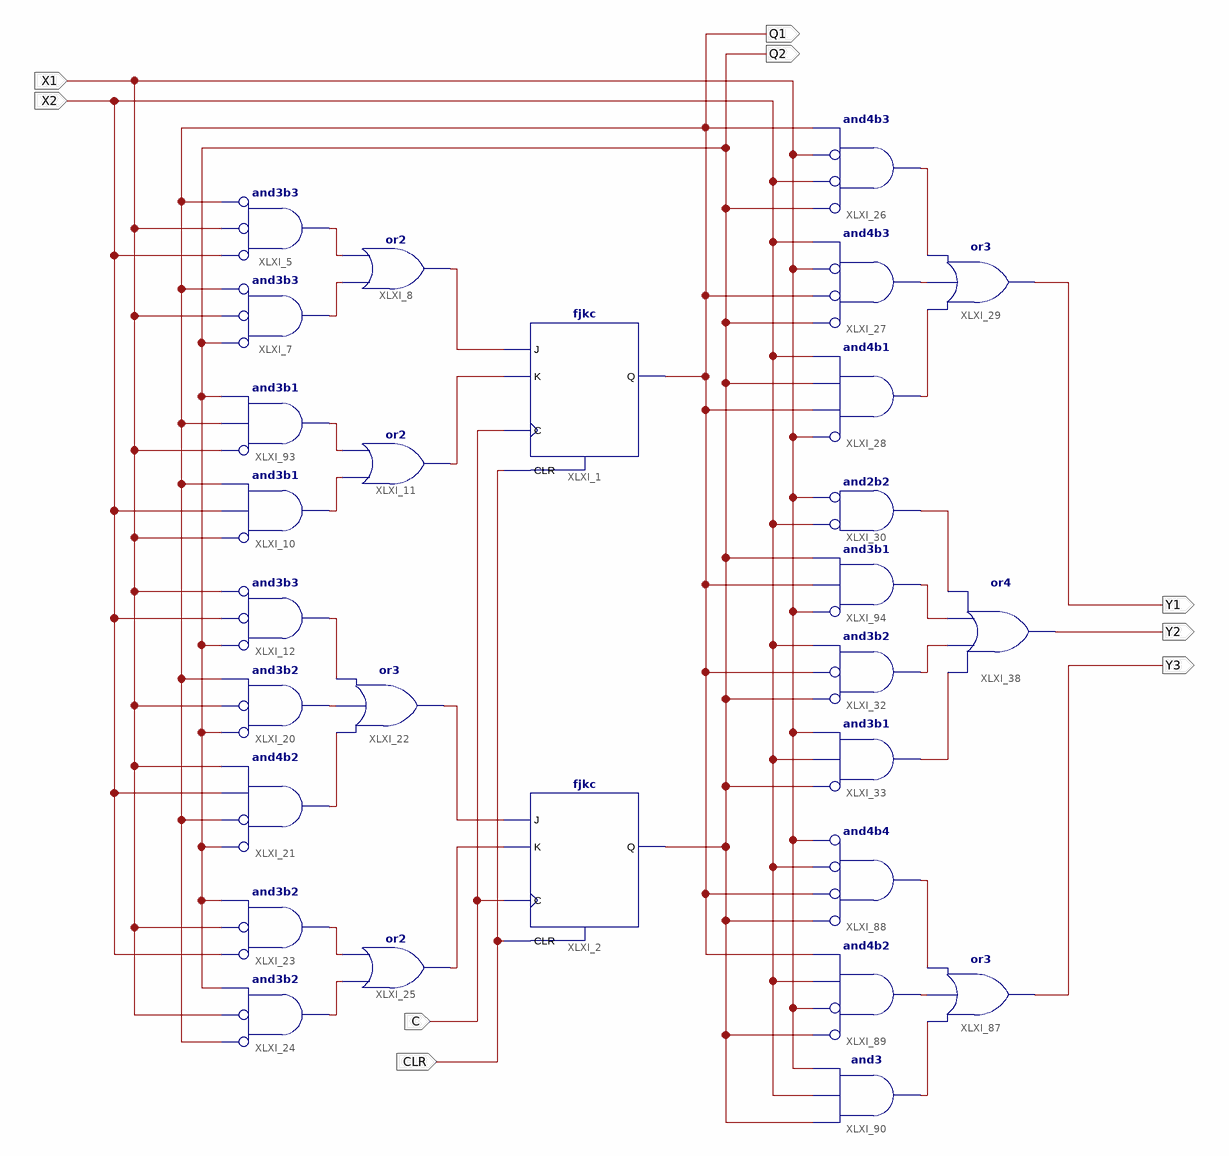
[diagram p0: schematic sheet 1]
// Xilinx ISE schematic scheme.sch (virtex5) as structural Verilog: 28 symbols, 9 ports
module scheme (
  input  X2,
  input  X1,
  input  CLR,
  input  C,
  output Q1,
  output Y1,
  output Y2,
  output Y3,
  output Q2
);

  wire XLXN_15, XLXN_16, XLXN_23, XLXN_24, XLXN_51, XLXN_52, XLXN_53, XLXN_59, XLXN_60, XLXN_71, XLXN_72,
       XLXN_73, XLXN_90, XLXN_91, XLXN_92, XLXN_93, XLXN_160, XLXN_161, XLXN_162, XLXN_175, XLXN_176,
       XLXN_241, XLXN_242;

  and XLXI_5 (XLXN_15, ~X2, ~X1, ~Q1);  // and3b3
  and XLXI_7 (XLXN_16, ~Q2, ~X1, ~Q1);  // and3b3
  or XLXI_8 (XLXN_175, XLXN_16, XLXN_15);
  and XLXI_93 (XLXN_23, ~X1, Q1, Q2);  // and3b1
  and XLXI_10 (XLXN_24, ~X1, X2, Q1);  // and3b1
  and XLXI_12 (XLXN_53, ~Q2, ~X2, ~X1);  // and3b3
  and XLXI_20 (XLXN_51, ~Q2, ~X1, Q1);  // and3b2
  and XLXI_21 (XLXN_52, ~Q2, ~Q1, X2, X1);  // and4b2
  and XLXI_23 (XLXN_60, ~X2, ~X1, Q2);  // and3b2
  and XLXI_24 (XLXN_59, ~Q1, ~X1, Q2);  // and3b2
  or XLXI_11 (XLXN_176, XLXN_24, XLXN_23);
  or XLXI_25 (XLXN_241, XLXN_59, XLXN_60);
  or XLXI_22 (XLXN_242, XLXN_52, XLXN_51, XLXN_53);
  fjkc XLXI_1 (.C(C), .CLR(CLR), .J(XLXN_175), .K(XLXN_176), .Q(Q1));
  fjkc XLXI_2 (.C(C), .CLR(CLR), .J(XLXN_242), .K(XLXN_241), .Q(Q2));
  and XLXI_26 (XLXN_73, ~Q2, ~X2, ~X1, Q1);  // and4b3
  and XLXI_27 (XLXN_71, ~Q2, ~Q1, ~X1, X2);  // and4b3
  and XLXI_28 (XLXN_72, ~X1, Q1, Q2, X2);  // and4b1
  or XLXI_29 (Y1, XLXN_72, XLXN_71, XLXN_73);
  and XLXI_30 (XLXN_90, ~X2, ~X1);  // and2b2
  and XLXI_94 (XLXN_91, ~X1, Q1, Q2);  // and3b1
  and XLXI_32 (XLXN_92, ~Q2, ~Q1, X2);  // and3b2
  and XLXI_33 (XLXN_93, ~Q2, X2, X1);  // and3b1
  and XLXI_88 (XLXN_162, ~Q2, ~Q1, ~X2, ~X1);  // and4b4
  and XLXI_89 (XLXN_161, ~Q2, ~X1, X2, Q1);  // and4b2
  and XLXI_90 (XLXN_160, Q2, X2, X1);
  or XLXI_38 (Y2, XLXN_93, XLXN_92, XLXN_91, XLXN_90);
  or XLXI_87 (Y3, XLXN_160, XLXN_161, XLXN_162);
endmodule
